# Altium schematic sheet usb.SchDoc: {Наименование}
size 209 x 297 mm; DocumentNumber: {Обозначение}; SheetNumber: {}; SheetTotal: {}; PageSetup: Record=PageOptions|CenterHorizontal=False|CenterVertical=False|PrintScale=0.95|XCorrection=0.00|YCorrection=0.00|PrintKind=1|BorderSize=5000000|LeftOffset=0|BottomOffset=0|Orientation=1|PaperLength=1000|PaperWidth=1000|Scale=100|PaperSource=15|PrintQuality=600|MediaType=1|DitherType=10|PaperKind=A4|PrintScaleMode=1; Rule: PcbType=ProtelPcb
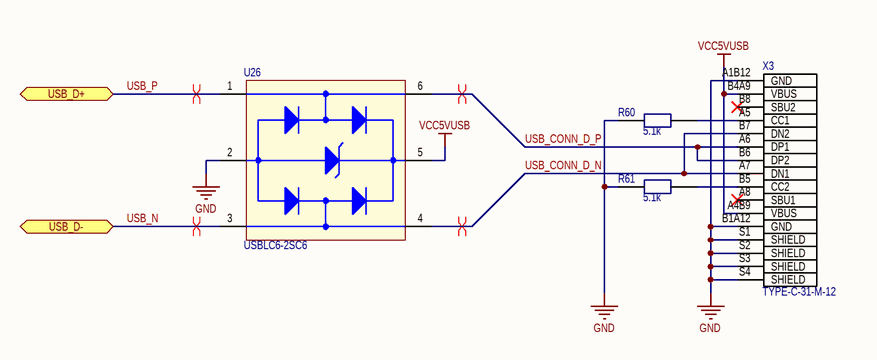
[diagram p0: usb.SchDoc]

## Parts
R60  5.1k  [R_0603]
R61  5.1k  [R_0603]
U26  USBLC6-2SC6  [SOT95P280X145-6N]
X3  TYPE-C-31-M-12  [HRO_TYPE-C-31-M-12]

## Ports
USB_D+ (bidir), USB_D- (bidir)

## Nets
GND: R60.1 R61.1 U26.2(GND) X3.A1B12(GND) X3.B1A12(GND) X3.S1(SHIELD) X3.S2(SHIELD) X3.S3(SHIELD) X3.S4(SHIELD)
VCC5VUSB: U26.5(VBUS) X3.A4B9(VBUS) X3.B4A9(VBUS)
USB_CONN_D_N: U26.4(I/O2_OUT) X3.A7(DN1) X3.B7(DN2)
USB_CONN_D_P: U26.6(I/O1_OUT) X3.A6(DP1) X3.B6(DP2)
USB_N: U26.3(I/O2_IN) ; port USB_D-
USB_P: U26.1(I/O1_IN) ; port USB_D+
NetR60_2: R60.2 X3.A5(CC1)
NetR61_2: R61.2 X3.B5(CC2)

Not connected (* = marked no-connect by the designer): X3 A8(SBU1)* B8(SBU2)*

## Layout directives
differential pair: USB_CONN_D_N, USB_CONN_D_P, USB_N, USB_P

## Library data of the parts
R60 R61 = RES_SMD: Resistor; Part Number: RC0603JR-075K1L; Alternative Part: *; Value: 5.1k
U26 = USBLC6-2SC6: 17V Clamp 5A (8/20Âµs) Ipp Tvs Diode Surface Mount SOT-23-6; MF: STMicroelectronics; Value: *; Check_prices: https://www.snapeda.com/parts/USBLC6-2SC6/STMicroelectronics/view-part/?ref=eda; MP: USBLC6-2SC6; Purchase-URL: https://pricing.snapeda.com/search/part/USBLC6-2SC6/?ref=eda; Price: None; Availability: In Stock; Package: SOT-23-6 STMicroelectronics; SnapEDA_Link: https://www.snapeda.com/parts/USBLC6-2SC6/STMicroelectronics/view-part/?ref=snap; Part Number: USBLC6-2SC6; Alternative Part: *
X3 = TYPE-C-31-M-12: USB Connectors 24 Receptacle 1 8.94*7.3mm RoHS; Package: None; Availability: Unavailable; Value: *; MP: TYPE-C-31-M-12; Price: None; Part Number: TYPE-C-31-M-12; Alternative Part: *